# Altium schematic sheet 2.SchDoc
size A4
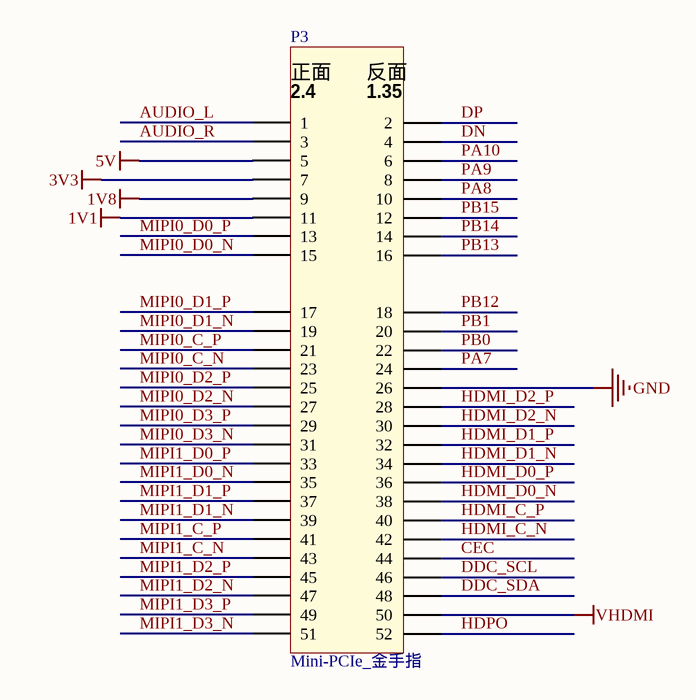
[diagram p0: 2.SchDoc]

## Parts
P3  value Mini-PCIe_金手指  [接口_Mini_PCIe_金手指]  (hidden comment: 接口_Mini-PCIe_金手指排序)

## Nets
1V1: P3.11
1V8: P3.9
3V3: P3.7
5V: P3.5
GND: P3.26
VHDMI: P3.50
AUDIO_L: P3.1
AUDIO_R: P3.3
CEC: P3.44
DDC_SCL: P3.46
DDC_SDA: P3.48
DN: P3.4
DP: P3.2
HDMI_C_N: P3.42
HDMI_C_P: P3.40
HDMI_D0_N: P3.38
HDMI_D0_P: P3.36
HDMI_D1_N: P3.34
HDMI_D1_P: P3.32
HDMI_D2_N: P3.30
HDMI_D2_P: P3.28
HDPO: P3.52
MIPI0_C_N: P3.23
MIPI0_C_P: P3.21
MIPI0_D0_N: P3.15
MIPI0_D0_P: P3.13
MIPI0_D1_N: P3.19
MIPI0_D1_P: P3.17
MIPI0_D2_N: P3.27
MIPI0_D2_P: P3.25
MIPI0_D3_N: P3.31
MIPI0_D3_P: P3.29
MIPI1_C_N: P3.43
MIPI1_C_P: P3.41
MIPI1_D0_N: P3.35
MIPI1_D0_P: P3.33
MIPI1_D1_N: P3.39
MIPI1_D1_P: P3.37
MIPI1_D2_N: P3.47
MIPI1_D2_P: P3.45
MIPI1_D3_N: P3.51
MIPI1_D3_P: P3.49
PA7: P3.24
PA8: P3.10
PA9: P3.8
PA10: P3.6
PB0: P3.22
PB1: P3.20
PB12: P3.18
PB13: P3.16
PB14: P3.14
PB15: P3.12

## Notes on the sheet
- (in symbol 接口_Mini-PCIe_金手指排序) 正面; 反面; 2.4; 1.35

## Library data of the parts
P3 = 接口_Mini-PCIe_金手指排序: 接口